# Altium project Signal_Processing_Board_Manta.PrjPcb (part 2 of 2)

## Sheet FILTER.SchDoc
size A3; Engineer: Hamit Karatas; SheetNumber: 2; SheetTotal: 2
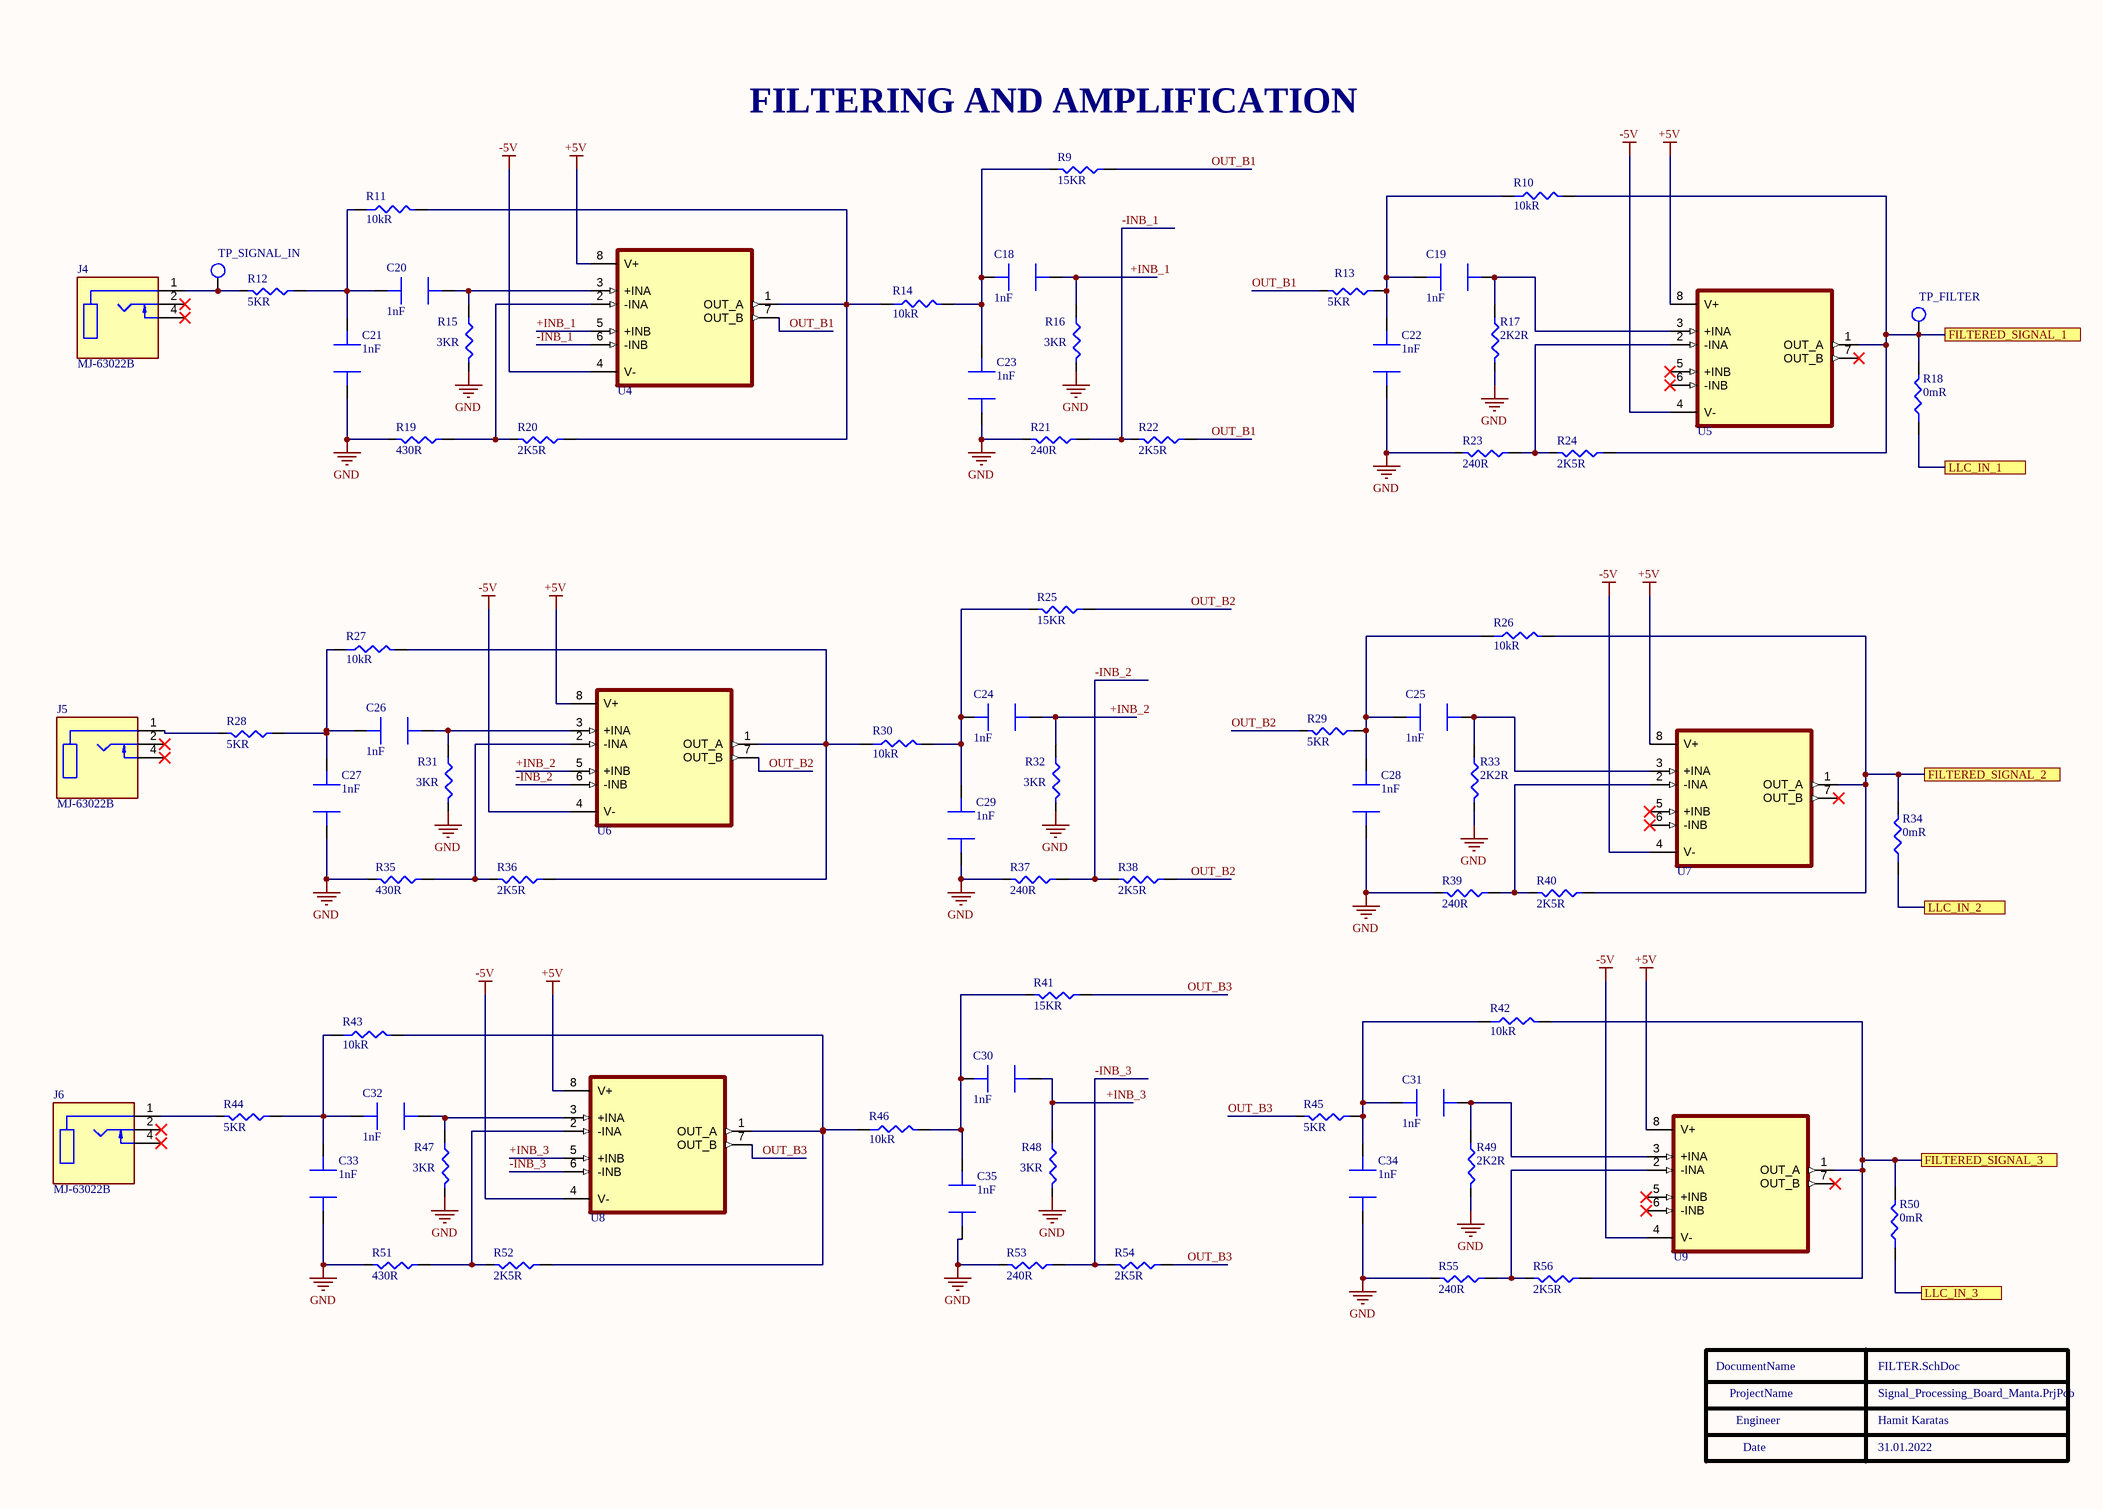
[diagram p1: FILTER.SchDoc]

### Parts
C18  Capacitance: 1nF  [CAP_1206]  (hidden comment: CAP CER 2.2uF)
C19  Capacitance: 1nF  [CAP_1206]  (hidden comment: CAP CER 2.2uF)
C20  Capacitance: 1nF  [CAP_1206]  (hidden comment: CAP CER 2.2uF)
C21  Capacitance: 1nF  [CAP_1206]  (hidden comment: CAP CER 2.2uF)
C22  Capacitance: 1nF  [CAP_1206]  (hidden comment: CAP CER 2.2uF)
C23  Capacitance: 1nF  [CAP_1206]  (hidden comment: CAP CER 2.2uF)
C24  Capacitance: 1nF  [CAP_1206]  (hidden comment: CAP CER 2.2uF)
C25  Capacitance: 1nF  [CAP_1206]  (hidden comment: CAP CER 2.2uF)
C26  Capacitance: 1nF  [CAP_1206]  (hidden comment: CAP CER 2.2uF)
C27  Capacitance: 1nF  [CAP_1206]  (hidden comment: CAP CER 2.2uF)
C28  Capacitance: 1nF  [CAP_1206]  (hidden comment: CAP CER 2.2uF)
C29  Capacitance: 1nF  [CAP_1206]  (hidden comment: CAP CER 2.2uF)
C30  Capacitance: 1nF  [CAP_1206]  (hidden comment: CAP CER 2.2uF)
C31  Capacitance: 1nF  [CAP_1206]  (hidden comment: CAP CER 2.2uF)
C32  Capacitance: 1nF  [CAP_1206]  (hidden comment: CAP CER 2.2uF)
C33  Capacitance: 1nF  [CAP_1206]  (hidden comment: CAP CER 2.2uF)
C34  Capacitance: 1nF  [CAP_1206]  (hidden comment: CAP CER 2.2uF)
C35  Capacitance: 1nF  [CAP_1206]  (hidden comment: CAP CER 2.2uF)
J4  MJ-63022B  [JACK FEMALE 6.3]
J5  MJ-63022B  [JACK FEMALE 6.3]
J6  MJ-63022B  [JACK FEMALE 6.3]
R9  Resistance: 15KR  [RES_0603]  (hidden comment: RC0603FR-0710KL)
R10  Resistance: 10kR  [RES_0603]  (hidden comment: RES 10K OHM 0603)
R11  Resistance: 10kR  [RES_0603]  (hidden comment: RES 10K OHM 0603)
R12  Resistance: 5KR  [RES_0603]  (hidden comment: RC0603FR-0710KL)
R13  Resistance: 5KR  [RES_0603]  (hidden comment: RC0603FR-0710KL)
R14  Resistance: 10kR  [RES_0603]  (hidden comment: RES 10K OHM 0603)
R15  Resistance: 3KR  [RES 0805]  (hidden comment: 430R)
R16  Resistance: 3KR  [RES 0805]  (hidden comment: 430R)
R17  Resistance: 2K2R  [RES_0603]  (hidden comment: RC0603FR-0710KL)
R18  Resistance: 0mR  [RES_0603]  (hidden comment: RC0603JR-070RL)
R19  430R  [RES 0805]
R20  Resistance: 2K5R  [RES_0603]  (hidden comment: RC0603FR-0710KL)
R21  Resistance: 240R  [RES 0805]  (hidden comment: 430R)
R22  Resistance: 2K5R  [RES_0603]  (hidden comment: RC0603FR-0710KL)
R23  Resistance: 240R  [RES 0805]  (hidden comment: 430R)
R24  Resistance: 2K5R  [RES_0603]  (hidden comment: RC0603FR-0710KL)
R25  Resistance: 15KR  [RES_0603]  (hidden comment: RC0603FR-0710KL)
R26  Resistance: 10kR  [RES_0603]  (hidden comment: RES 10K OHM 0603)
R27  Resistance: 10kR  [RES_0603]  (hidden comment: RES 10K OHM 0603)
R28  Resistance: 5KR  [RES_0603]  (hidden comment: RC0603FR-0710KL)
R29  Resistance: 5KR  [RES_0603]  (hidden comment: RC0603FR-0710KL)
R30  Resistance: 10kR  [RES_0603]  (hidden comment: RES 10K OHM 0603)
R31  Resistance: 3KR  [RES 0805]  (hidden comment: 430R)
R32  Resistance: 3KR  [RES 0805]  (hidden comment: 430R)
R33  Resistance: 2K2R  [RES_0603]  (hidden comment: RC0603FR-0710KL)
R34  Resistance: 0mR  [RES_0603]  (hidden comment: RC0603JR-070RL)
R35  430R  [RES 0805]
R36  Resistance: 2K5R  [RES_0603]  (hidden comment: RC0603FR-0710KL)
R37  Resistance: 240R  [RES 0805]  (hidden comment: 430R)
R38  Resistance: 2K5R  [RES_0603]  (hidden comment: RC0603FR-0710KL)
R39  Resistance: 240R  [RES 0805]  (hidden comment: 430R)
R40  Resistance: 2K5R  [RES_0603]  (hidden comment: RC0603FR-0710KL)
R41  Resistance: 15KR  [RES_0603]  (hidden comment: RC0603FR-0710KL)
R42  Resistance: 10kR  [RES_0603]  (hidden comment: RES 10K OHM 0603)
R43  Resistance: 10kR  [RES_0603]  (hidden comment: RES 10K OHM 0603)
R44  Resistance: 5KR  [RES_0603]  (hidden comment: RC0603FR-0710KL)
R45  Resistance: 5KR  [RES_0603]  (hidden comment: RC0603FR-0710KL)
R46  Resistance: 10kR  [RES_0603]  (hidden comment: RES 10K OHM 0603)
R47  Resistance: 3KR  [RES 0805]  (hidden comment: 430R)
R48  Resistance: 3KR  [RES 0805]  (hidden comment: 430R)
R49  Resistance: 2K2R  [RES_0603]  (hidden comment: RC0603FR-0710KL)
R50  Resistance: 0mR  [RES_0603]  (hidden comment: RC0603JR-070RL)
R51  430R  [RES 0805]
R52  Resistance: 2K5R  [RES_0603]  (hidden comment: RC0603FR-0710KL)
R53  Resistance: 240R  [RES 0805]  (hidden comment: 430R)
R54  Resistance: 2K5R  [RES_0603]  (hidden comment: RC0603FR-0710KL)
R55  Resistance: 240R  [RES 0805]  (hidden comment: 430R)
R56  Resistance: 2K5R  [RES_0603]  (hidden comment: RC0603FR-0710KL)
TP_FILTER  TEST_POINT  [TEST POINT]  (value not drawn)  (no BOM)
TP_SIGNAL_IN  TEST_POINT  [TEST POINT]  (value not drawn)  (no BOM)
U4  Opamp lmh6612  [SOIC-8]  (value not drawn)
U5  Opamp lmh6612  [SOIC-8]  (value not drawn)
U6  Opamp lmh6612  [SOIC-8]  (value not drawn)
U7  Opamp lmh6612  [SOIC-8]  (value not drawn)
U8  Opamp lmh6612  [SOIC-8]  (value not drawn)
U9  Opamp lmh6612  [SOIC-8]  (value not drawn)

### Ports
FILTERED_SIGNAL_1, FILTERED_SIGNAL_2, FILTERED_SIGNAL_3, LLC_IN_1, LLC_IN_2, LLC_IN_3

### Nets
+5V: U4.8(V+) U5.8(V+) U6.8(V+) U7.8(V+) U8.8(V+) U9.8(V+)
-5V: U4.4(V-) U5.4(V-) U6.4(V-) U7.4(V-) U8.4(V-) U9.4(V-)
GND: C21.1 C22.1 C23.1 C27.1 C28.1 C29.1 C33.1 C34.1 C35.1 R15.1 R16.1 R17.1 R19.1 R21.1 R23.1 R31.1 R32.1 R33.1 R35.1 R37.1 R39.1 R47.1 R48.1 R49.1 R51.1 R53.1 R55.1
+INB_1: C18.2 R16.2 U4.5(+INB)
+INB_2: C24.2 R32.2 U6.5(+INB)
+INB_3: C30.2 R48.2 U8.5(+INB)
-INB_1: R21.2 R22.1 U4.6(-INB)
-INB_2: R37.2 R38.1 U6.6(-INB)
-INB_3: R53.2 R54.1 U8.6(-INB)
OUT_B1: R9.2 R13.1 R22.2 U4.7(OUT_B)
OUT_B2: R25.2 R29.1 R38.2 U6.7(OUT_B)
OUT_B3: R41.2 R45.1 R54.2 U8.7(OUT_B)
NetC18_1: C18.1 C23.2 R9.1 R14.2
NetC19_1: C19.1 R17.2 U5.3(+INA)
NetC19_2: C19.2 C22.2 R10.1 R13.2
NetC20_1: C20.1 C21.2 R11.1 R12.2
NetC20_2: C20.2 R15.2 U4.3(+INA)
NetC24_1: C24.1 C29.2 R25.1 R30.2
NetC25_1: C25.1 R33.2 U7.3(+INA)
NetC25_2: C25.2 C28.2 R26.1 R29.2
NetC26_1: C26.1 C27.2 R27.1 R28.2
NetC26_2: C26.2 R31.2 U6.3(+INA)
NetC30_1: C30.1 C35.2 R41.1 R46.2
NetC31_1: C31.1 R49.2 U9.3(+INA)
NetC31_2: C31.2 C34.2 R42.1 R45.2
NetC32_1: C32.1 C33.2 R43.1 R44.2
NetC32_2: C32.2 R47.2 U8.3(+INA)
NetJ4_1: J4.1(SLEEVE) R12.1 TP_SIGNAL_IN.1(TP)
NetJ5_1: J5.1(SLEEVE) R28.1
NetJ6_1: J6.1(SLEEVE) R44.1
NetR5_2: R50.1 ; port LLC_IN_3
NetR6_2: R34.1 ; port LLC_IN_2
NetR8_2: R18.1 ; port LLC_IN_1
NetR10_2: R10.2 R18.2 R24.2 TP_FILTER.1(TP) U5.1(OUT_A) ; port FILTERED_SIGNAL_1
NetR11_2: R11.2 R14.1 R20.2 U4.1(OUT_A)
NetR19_2: R19.2 R20.1 U4.2(-INA)
NetR23_2: R23.2 R24.1 U5.2(-INA)
NetR26_2: R26.2 R34.2 R40.2 U7.1(OUT_A) ; port FILTERED_SIGNAL_2
NetR27_2: R27.2 R30.1 R36.2 U6.1(OUT_A)
NetR35_2: R35.2 R36.1 U6.2(-INA)
NetR39_2: R39.2 R40.1 U7.2(-INA)
NetR42_2: R42.2 R50.2 R56.2 U9.1(OUT_A) ; port FILTERED_SIGNAL_3
NetR43_2: R43.2 R46.1 R52.2 U8.1(OUT_A)
NetR51_2: R51.2 R52.1 U8.2(-INA)
NetR55_2: R55.2 R56.1 U9.2(-INA)

Not connected (* = marked no-connect by the designer): J4 2(TIP)* 4(TIP_SWITCH)*; J5 2(TIP)* 4(TIP_SWITCH)*; J6 2(TIP)* 4(TIP_SWITCH)*; U5 5(+INB)* 6(-INB)* 7(OUT_B)*; U7 5(+INB)* 6(-INB)* 7(OUT_B)*; U9 5(+INB)* 6(-INB)* 7(OUT_B)*

### Notes on the sheet
- (near R9) FILTERING AND AMPLIFICATION
- sadece 1 numaralı pini opampa bağlamak yeterli gibi. diğerleri switch işlemi gözüküyor, kulaklık takılıyken hoperlörü kapatmak gibi. bu uygulamada gereksiz
- DocumentName
- ProjectName
- Engineer
- Date
- 31.01.2022
- THIS DOCUMENT AND THE DATA DISCLOSED HEREIN OR
- HEREWITH IS THE PROPERTY OF ALTIUM LIMITED AND MAY
- DWG NO:
- REVISION
- REV:
- DESCRIPTION
- DATE
- APPROVED
- BE FREELY DISTRIBUTED IN WHOLE. NO RIGHTS ARE
- RESERVED OR EXPRESS OR IMPLIED WARANTEE GIVEN.
- ENG:
- APPROVALS
- PROJECT
- DSN:
- CHK:
- REFERENCE DOCUMENTS
- PROJECT REVISION:
- TITLE
- DOCUMENT REVISION:
- DESIGN ITEM:
- BOM:
- FAB DWG:
- PCB DWG:
- ASSY DWG:
- SCALE:
- A3
- SIZE
- CAGE CODE
- FILE NAME
- DWG NO.
- SHEET
- OF
- REV
- 31.01.2000

### Library data of the parts
C18-C35 = CAP CER 2.2uF: Cap Ceramic 2.2uF 16V X7R 10% SMD 1206 125°C Plastic T/R; Manufacturer: KEMET; Manufacturer Part Number: C1206C225K4RACTU; Dissipation Factor: 5%; Supplier 1: Digi-Key; RoHS: Yes; Category: Ceramic Capacitors; Stock 1: 42974; Pricing 1: 1=0,36000, 10=0,24800, 50=0,16500, 100=0,14020, 500=0,09900, 1000=0,08662 (USD); Mount: Surface Mount,PCB; Case/Package: 1206; Case Code (Imperial): 1206; Case Code (Metric): 3216; Dielectric Material: Ceramic; Min Operating Temperature: -55°C; Max Operating Temperature: 125°C; Tolerance: 10%; Voltage Rating: 16V; Voltage Rating (DC): 16V; Packaging: Tape and Reel; Package Quantity: 1; Termination: SMD/SMT; Voltage: 16V; Dielectric: X7R; Series: C; Construction: Flat; Length: 3.2mm; Width: 1.6mm; Height: 1mm; Depth: 1.6mm; Thickness: 0.071inch; Radiation Hardening: No; REACH SVHC: No SVHC; RoHS Compliant: Yes; ComponentLink1URL: https://datasheet.ciiva.com/39122/docfinderpartnumberc0402c102k5ractu-39122950.pdf?src-supplier=Onlinecomponents.com; ComponentLink1Description: https://datasheet.ciiva.com/39122/docfinderpartnumberc0402c102k5ractu-39122950.pdf?src-supplier=Onlinecomponents.com; ComponentLink2URL: https://datasheet.ciiva.com/14609/70095383-14609275.pdf?src-supplier=Allied+Electronics; ComponentLink2Description: https://datasheet.ciiva.com/14609/70095383-14609275.pdf?src-supplier=Allied+Electronics; ComponentLink3URL: https://datasheet.ciiva.com/28688/1851736-28688683.pdf?src-supplier=Element14; ComponentLink3Description: https://datasheet.ciiva.com/28688/1851736-28688683.pdf?src-supplier=Element14; ComponentLink4URL: https://datasheet.ciiva.com/7730/kem-c1002-x7r-smd-7730124.pdf?src-supplier=Element14; ComponentLink4Description: https://datasheet.ciiva.com/7730/kem-c1002-x7r-smd-7730124.pdf?src-supplier=Element14; ComponentLink5URL: https://datasheet.ciiva.com/5969/kem-c1002-x7r-smd-5969822.pdf?src-supplier=Farnell; ComponentLink5Description: https://datasheet.ciiva.com/5969/kem-c1002-x7r-smd-5969822.pdf?src-supplier=Farnell; Supplier Part Number 1: 399-C1206C225K4RAC7800DKR-ND
J4-J6 = MJ-63022B: Conn Audio Jack F 2 POS Solder RA Thru-Hole 3 Terminal 1 Port Bulk; Manufacturer: CUI Devices; Supplier 1: Digi-Key; Manufacturer Part Number: MJ-63022B; RoHS: Yes; Category: Audio / Video Connectors; Stock 1: 1434; Pricing 1: 1=1,48000, 10=1,29200, 25=1,23760, 50=1,21000, 100=1,15500, 250=1,04500, 500=0,96250, 1000=0,82500, 2500=0,77000 (USD); Supplier Part Number 1: 2223-MJ-63022B-ND
R9 R12 R13 R17 R20 R22 R24 R25 R28 R29 R33 R36 R38 R40 R41 R44 R45 R49 R52 R54 R56 = RES 1K OHM 0603: RES 1K %1 OHM 0603 SMD; Manufacturer: Yageo; Manufacturer Part Number: RC0603JR-071KL; Designed by: Hamit; Tolerance: 5%; Temperature Coefficient: 100ppm/°C; Voltage Rating (DC): 50V; Power Rating: 100mW; Body Length: 1.6mm; Supplier 1: Digi-Key; RoHS: Yes; Category: Chip SMD Resistors; Stock 1: 5112056; Pricing 1: 1=0,10000, 10=0,01900, 100=0,00770, 1000=0,00344, 2500=0,00298 (USD); Case/Package: 0603; Number of Pins: 2; Contact Plating: Tin,Matte; Case Code (Imperial): 0603; Case Code (Metric): 1608; Size Code: 0603; Min Operating Temperature: -55°C; Max Operating Temperature: 155°C; Resistor Type: Thick Film; Packaging: Tape and Reel; Package Quantity: 5000; Voltage Rating: 50V; Termination: SMD/SMT; Series: RC; Resistance Tolerance: 5%; Construction: Rectangular; Length: 1.6mm; Width: 0.8mm; Height: 0.45mm; Depth: 0.8mm; Radiation Hardening: No; REACH SVHC: Unknown; Lead Free: Lead Free; Military Standard: Not; RoHS Compliant: Yes; ComponentLink1URL: https://datasheet.ciiva.com/8883/pyu-rc0603-51-rohs-l-4-8883051.pdf?src-supplier=Avnet; ComponentLink1Description: https://datasheet.ciiva.com/8883/pyu-rc0603-51-rohs-l-4-8883051.pdf?src-supplier=Avnet; ComponentLink2URL: https://datasheet.ciiva.com/7746/443971-7746461.pdf?src-supplier=Element14; ComponentLink2Description: https://datasheet.ciiva.com/7746/443971-7746461.pdf?src-supplier=Element14; ComponentLink3URL: https://datasheet.ciiva.com/22747/443971-22747533.pdf?src-supplier=Element14; ComponentLink3Description: https://datasheet.ciiva.com/22747/443971-22747533.pdf?src-supplier=Element14; ComponentLink4URL: https://datasheet.ciiva.com/7746/443971-7746462.pdf?src-supplier=Element14; ComponentLink4Description: https://datasheet.ciiva.com/7746/443971-7746462.pdf?src-supplier=Element14; Supplier Part Number 1: 311-1.0KGRCT-ND
R10 R11 R14 R26 R27 R30 R42 R43 R46 = RES 10K OHM 0603: Res General Purpose Thick Film 0603 10K Ohm 1% 1/10W ±100ppm/°C Molded SMD Paper T/R; Manufacturer: Yageo; Manufacturer Part Number: RC0603FR-0710KL; Voltage Rating (DC): 50V; Power Rating: 100mW; Voltage Rating: 75V; Designed by: Hamit; Supplier 1: Digi-Key; RoHS: Yes; Category: Chip SMD Resistors; Stock 1: 28304153; Pricing 1: 1=0,10000, 10=0,02400, 100=0,00970, 1000=0,00436, 2500=0,00378 (USD); Case/Package: 0603; Number of Pins: 2; Case Code (Imperial): 0603; Case Code (Metric): 1608; Weight: 7.1E-05oz; Size Code: 0603; Min Operating Temperature: -55°C; Max Operating Temperature: 155°C; Tolerance: 1%; Resistor Type: Thick Film; Temperature Coefficient: 100ppm/°C; Packaging: Tape and Reel; Termination: SMD/SMT; Features: Moisture Resistant; Series: RC; Max Power Dissipation: 100mW; Number of Terminations: 2; Resistance Tolerance: 1%; Construction: Rectangular; Length: 1.6mm; Width: 0.8mm; Height: 0.45mm; Depth: 0.8mm; Lead Pitch: 0.3mm; REACH SVHC: Unknown; Lead Free: Lead Free; Military Standard: Not; RoHS Compliant: Yes; ComponentLink1URL: https://datasheet.ciiva.com/7660/38590-7660789.pdf?src-supplier=Element14; ComponentLink1Description: https://datasheet.ciiva.com/7660/38590-7660789.pdf?src-supplier=Element14; ComponentLink2URL: https://datasheet.ciiva.com/7983/443971-7983596.pdf?src-supplier=Element14; ComponentLink2Description: https://datasheet.ciiva.com/7983/443971-7983596.pdf?src-supplier=Element14; ComponentLink3URL: https://datasheet.ciiva.com/22747/443971-22747519.pdf?src-supplier=Element14; ComponentLink3Description: https://datasheet.ciiva.com/22747/443971-22747519.pdf?src-supplier=Element14; ComponentLink4URL: https://datasheet.ciiva.com/46440/1868787-46440891.pdf?src-supplier=Element14; ComponentLink4Description: https://datasheet.ciiva.com/46440/1868787-46440891.pdf?src-supplier=Element14; ComponentLink5URL: https://datasheet.ciiva.com/7746/1738695-7746239.pdf?src-supplier=Element14; ComponentLink5Description: https://datasheet.ciiva.com/7746/1738695-7746239.pdf?src-supplier=Element14; ComponentLink6URL: https://datasheet.ciiva.com/15189/getdatasheetpartid-409289-15189591.pdf?src-supplier=Verical; ComponentLink6Description: https://datasheet.ciiva.com/15189/getdatasheetpartid-409289-15189591.pdf?src-supplier=Verical; Supplier Part Number 1: 311-10.0KHRCT-ND
R15 R16 R19 R21 R23 R31 R32 R35 R37 R39 R47 R48 R51 R53 R55 = RES 430 OHM 0805: Res Thick Film 0805 430 Ohm 1% 1/8W ±100ppm/°C Molded SMD SMD Paper T/R; Manufacturer: Stackpole Electronics; Manufacturer Part Number: RMCF0805FT430R; Max Power Dissipation: 125mW; Supplier 1: Digi-Key; RoHS: Yes; Category: Chip SMD Resistors; Stock 1: 20552; Pricing 1: 1=0,10000, 10=0,02700, 100=0,01090, 1000=0,00488, 2500=0,00423 (USD); Mount: Surface Mount; Case/Package: 0805; Case Code (Metric): 2012; Case Code (Imperial): 0805; Contact Plating: Tin,Matte; Min Operating Temperature: -55°C; Max Operating Temperature: 155°C; Packaging: Tape and Reel; Tolerance: 1%; Resistor Type: Thick Film; Number of Terminations: 2; Temperature Coefficient: 100ppm/°C; Features: Automotive AEC-Q200; Series: RMCF; Length: 0.079inch; Width: 0.049inch; Height: 0.026inch; Radiation Hardening: No; Lead Free: Lead Free; RoHS Compliant: Yes; ComponentLink1URL: https://www.seielect.com/catalog/SEI-RMCF_RMCP.pdf?src-supplier=Avnet; ComponentLink1Description: https://www.seielect.com/catalog/SEI-RMCF_RMCP.pdf?src-supplier=Avnet; ComponentLink2URL: https://www.seielect.com/Catalog/SEI-RMCF_RMCP.pdf?src-supplier=Digi-Key; ComponentLink2Description: https://www.seielect.com/Catalog/SEI-RMCF_RMCP.pdf?src-supplier=Digi-Key; Supplier Part Number 1: RMCF0805FT430RCT-ND
  R19 R35 R51: Resistance: 430R
R18 R34 R50 = RES 0 ohm 0603: RES SMD 0 OHM JUMPER 1/10W 0603; Manufacturer: Yageo; Designed by: Hamit; Tolerance: 1%; Power Rating: 100mW; Voltage Rating (DC): 50V; Temperature Coefficient: 200ppm/°C; Resistance Tolerance: 5%; Supplier 1: Digi-Key; Manufacturer Part Number: RC0603JR-070RL; RoHS: Yes; Category: Chip SMD Resistors; Stock 1: 6474034; Pricing 1: 1=0,10000, 10=0,01700, 25=0,01240, 50=0,00940, 100=0,00700, 250=0,00532, 500=0,00424, 1000=0,00313 (USD); Case/Package: 0603; Number of Pins: 2; Contact Plating: Tin,Matte; Case Code (Imperial): 0603; Case Code (Metric): 1608; Size Code: 0603; Min Operating Temperature: -55°C; Max Operating Temperature: 155°C; Resistor Type: Thick Film; Packaging: Tape and Reel; Termination: SMD/SMT; Series: RC; Technology: THICK FILM; Package Quantity: 5000; Voltage Rating: 50V; Features: Moisture Resistant; Max Power Dissipation: 100mW; Number of Terminations: 2; Construction: Rectangular; Length: 1.6mm; Width: 0.8mm; Height: 0.45mm; Depth: 0.8mm; Radiation Hardening: No; REACH SVHC: No SVHC; Lead Free: Lead Free; RoHS Compliant: Yes; Military Standard: Not; Supplier Part Number 1: 311-0.0GRDKR-ND
TP_FILTER TP_SIGNAL_IN = TEST POINT
U4-U9 = Opamp lmh6612: Single Supply, Dual 345 MHz Rail-to-Rail Output Amplifier and PLC Line Driver 8-SOIC -40 to 125; Manufacturer: TI National Semiconductor; Manufacturer Part Number: LMH6612MAX/NOPB; Min Dual Supply Voltage: 1.35V; Max Supply Voltage: 11V; Number of Channels: 2; Output Current: 100mA; Max Dual Supply Voltage: 5.5V; Min Supply Voltage: 2.7V; Voltage Gain: 103dB; Gain Bandwidth Product: 130MHz; Common Mode Rejection Ratio: 81dB; Slew Rate: 460V/µs; Nominal Supply Current: 3.2mA; -3db Bandwidth: 365MHz; Input Offset Voltage (Vos): 95uV; Input Bias Current: 6.5uA; Operating Supply Current: 3.45mA; Output Current per Channel: 120mA; Amplifier Type: GENERAL PURPOSE; Supplier 1: Digi-Key; RoHS: Yes; Category: Amplifiers - Op Amps, Buffer, Instrumentation; Stock 1: 2483; Pricing 1: 1=2,59000, 10=2,32300, 25=2,19160, 100=1,86720, 250=1,75324, 500=1,53408, 1000=1,44725 (USD); Mount: Surface Mount; Case/Package: SOIC; Number of Pins: 8; Contact Plating: Tin,Matte; Min Operating Temperature: -40°C; Max Operating Temperature: 125°C; Packaging: Tape and Reel; Package Quantity: 2500; Unity Gain Bandwidth Product: 130MHz; Number of Circuits: 2; Number of Elements: 2; Power Supply Rejection Ratio (PSRR): 81dB; Supply Current: 3.2mA; Series: PowerWise®; Radiation Hardening: No; RoHS Compliant: Yes; Lead Free: Lead Free; ComponentLink1URL: https://datasheet.ciiva.com/14457/lmh6612-14457899.pdf?src-supplier=Avnet; ComponentLink1Description: https://datasheet.ciiva.com/14457/lmh6612-14457899.pdf?src-supplier=Avnet; ComponentLink2URL: https://datasheet.ciiva.com/6628/lmh6611-6628955.pdf?src-supplier=Digi-Key; ComponentLink2Description: https://datasheet.ciiva.com/6628/lmh6611-6628955.pdf?src-supplier=Digi-Key; Supplier Part Number 1: 296-46310-1-ND

## Nets that join several sheets
+5V: MCU (16 pins), FILTER (6 pins)
-5V: MCU (C14.2 TP_-5V.1 U1.1), FILTER (6 pins)
GND: MCU (33 pins), FILTER (27 pins)
NetR5_2: MCU (R5.2), FILTER (R50.1)
NetR6_2: MCU (R6.2), FILTER (R34.1)
NetR8_2: MCU (R8.2 TP_LLCIN.1), FILTER (R18.1)
NetR10_2: MCU (U3.13), FILTER (5 pins)
NetR26_2: MCU (U3.16), FILTER (R26.2 R34.2 R40.2 U7.1)
NetR42_2: MCU (U3.19), FILTER (R42.2 R50.2 R56.2 U9.1)